# Altium project STM8S003F3P6_RF_1RELAY_LEARN_CODE.PrjPcb
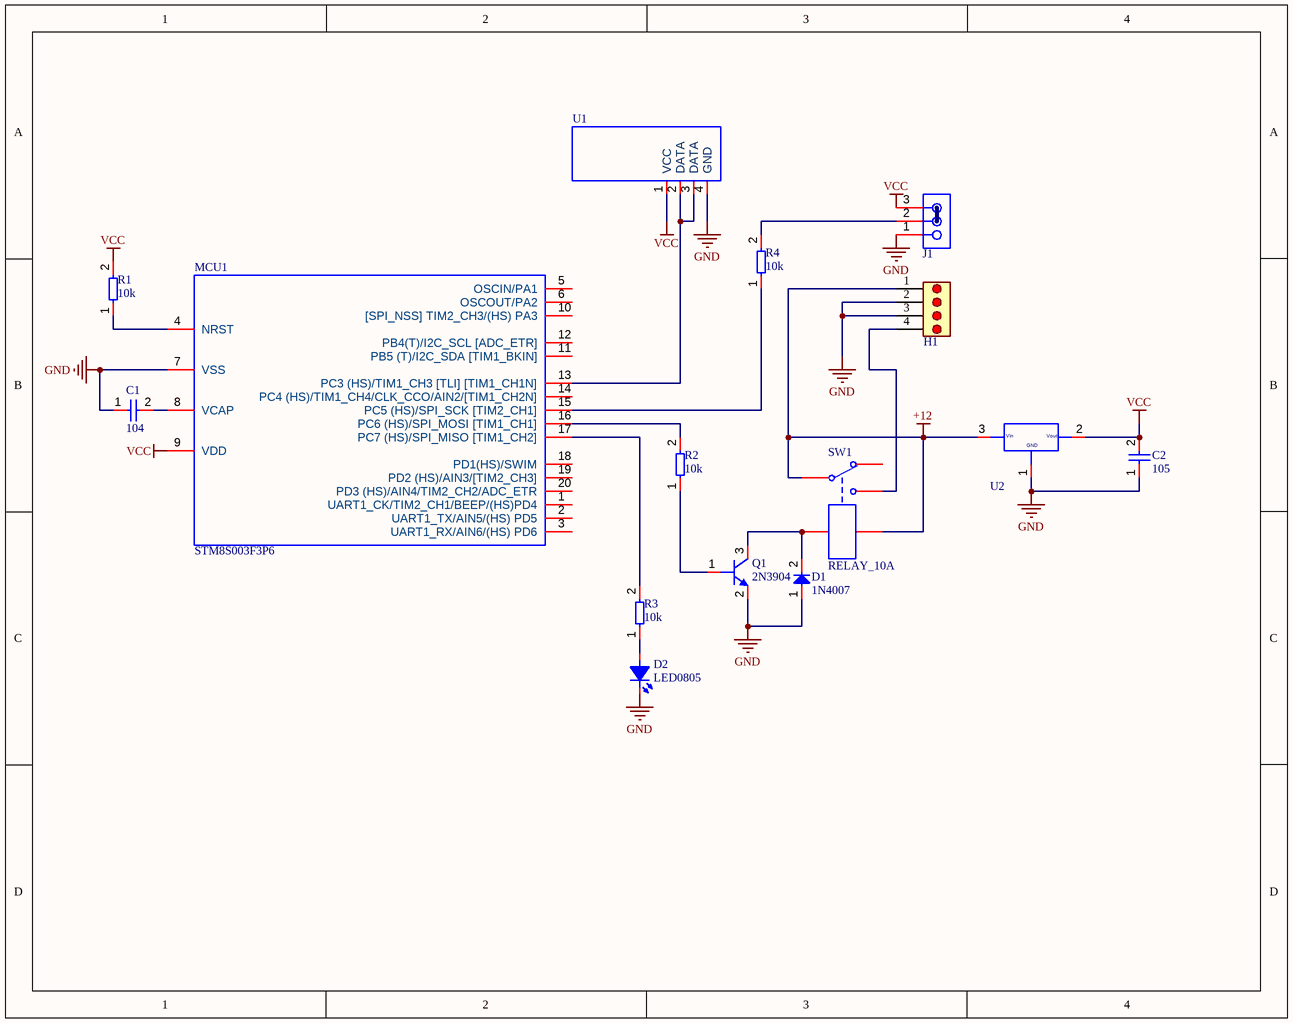
[diagram p0: STM8S003F3P6_RF_1RELAY_LEARN_CODE.SchDoc]
1 sheet, 15 parts. Net scope: global (net labels, ports and power ports of the same name join across sheets).
Board file: STM8S003F3P6_RF_1RELAY_LEARN_CODE.PcbDoc

## Sheet STM8S003F3P6_RF_1RELAY_LEARN_CODE.SchDoc
size A

### Parts
C1  104  [C0805]
C2  105  [C1206]
D1  1N4007  [DO-214AC(SMA)]
D2  LED0805  [L0805RED]
H1  Header 4  [HEADER 4]  (value not drawn)
J1  Header 3x1 TH Pitch 2.54mm  [Header 3x1 TH Pitch 2.54mm]  (value not drawn)
MCU1  STM8S003F3P6  [TSSOP20_0.65_4.4]
Q1  2N3904  [SOT23-3]
R1  10k  [R0805]
R2  10k  [R0805]
R3  10k  [R0805]
R4  10k  [R0805]
SW1  RELAY_10A  [RELAY_10A_5PIN]
U1  RF433_315_RECEVICE  [RF433_315_RECEVICE]  (value not drawn)
U2  AMS1117  [SOT223-3]  (value not drawn)

### Nets
+12: H1.1 SW1.2 SW1.3 U2.3
GND: C1.1 C2.1 D1.1 D2.2(K) H1.2 H1.3 J1.1 MCU1.7(VSS) Q1.2(E) U1.4(GND) U2.1
VCC: C2.2 J1.3 MCU1.9(VDD) R1.2 U1.1(VCC) U2.2
NetC1_2: C1.2 MCU1.8(VCAP)
NetD1_2: D1.2 Q1.3(C) SW1.1
NetD2_1: D2.1(A) R3.1
NetH1_4: H1.4 SW1.5
NetJ1_2: J1.2 R4.2
NetMCU1_4: MCU1.4(NRST) R1.1
NetMCU1_13: MCU1.13(PC3_(HS)/TIM1_CH3_[TLI]_[TIM1_CH1N]) U1.2(DATA) U1.3(DATA)
NetMCU1_15: MCU1.15(PC5_(HS)/SPI_SCK_[TIM2_CH1]) R4.1
NetMCU1_16: MCU1.16(PC6_(HS)/SPI_MOSI_[TIM1_CH1]) R2.2
NetMCU1_17: MCU1.17(PC7_(HS)/SPI_MISO_[TIM1_CH2]) R3.2
NetQ1_1: Q1.1(B) R2.1

Not connected (* = marked no-connect by the designer): MCU1 1(UART1_CK/TIM2_CH1/BEEP/(HS)PD4) 2(UART1_TX/AIN5/(HS)_PD5) 3(UART1_RX/AIN6/(HS)_PD6) 5(OSCIN/PA1) 6(OSCOUT/PA2) 10([SPI_NSS]_TIM2_CH3/(HS)_PA3) 11(PB5_(T)/I2C_SDA_[TIM1_BKIN]) 12(PB4(T)/I2C_SCL_[ADC_ETR]) 14(PC4_(HS)/TIM1_CH4/CLK_CCO/AIN2/[TIM1_CH2N]) 18(PD1(HS)/SWIM) 19(PD2_(HS)/AIN3/[TIM2_CH3]) 20(PD3_(HS)/AIN4/TIM2_CH2/ADC_ETR); SW1 4

### Notes on the sheet
- (in symbol AMS1117(SOT-223)) Vin; Vout; GND

### Library data of the parts
C1 = C0805
C2 = C1206
D1 = Diode 1N4007-DO214AC(SMA)
Q1 = 2N3904 (SOT-23)
R1-R4 = Resistor SMD
U1 = RF433_315
U2 = AMS1117(SOT-223)